# EAGLE design ampli_piezo (EAGLE 6.1)
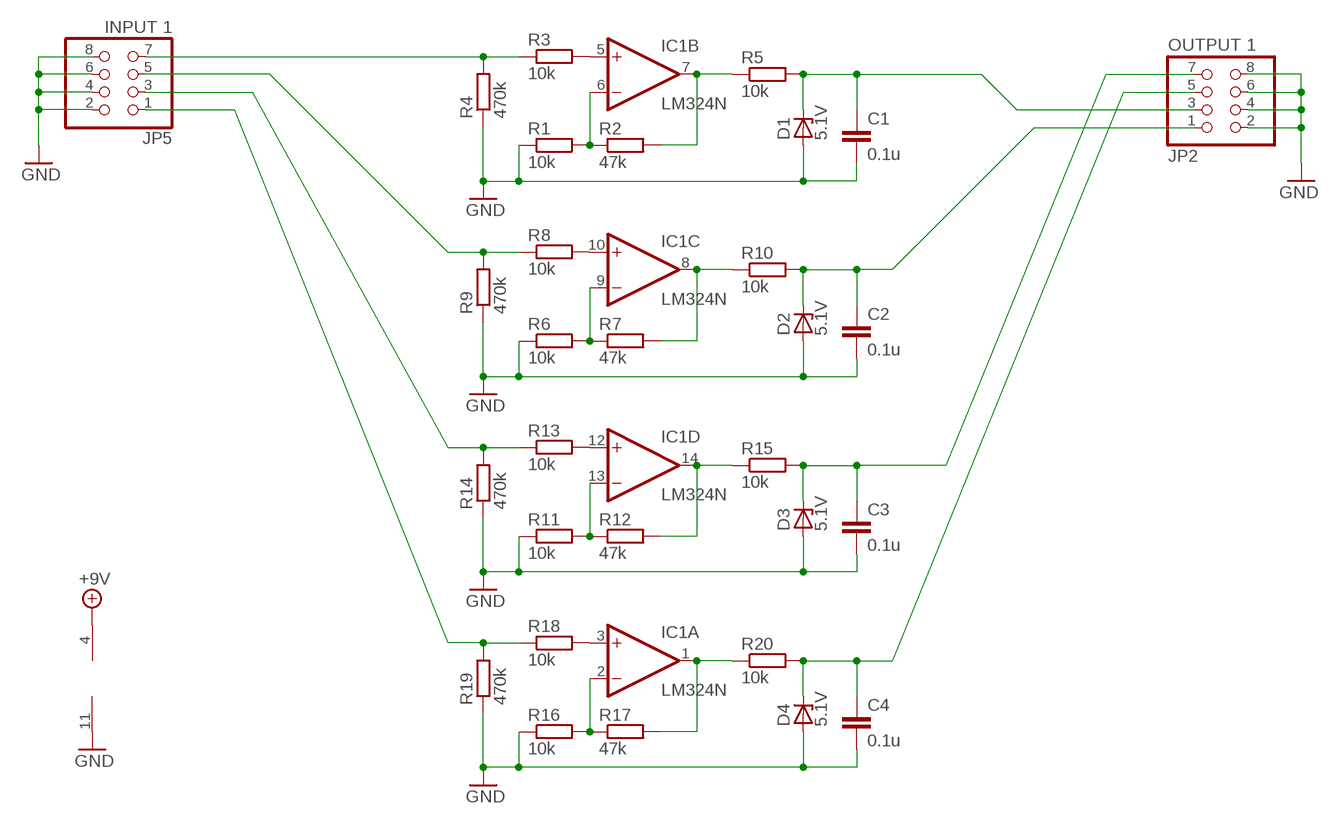
[diagram p0: schematic, sheet 1]

## Parts
C1  0.1u  C-EU050-025X075  [C050-025X075]
C2  0.1u  C-EU050-025X075  [C050-025X075]
C3  0.1u  C-EU050-025X075  [C050-025X075]
C4  0.1u  C-EU050-025X075  [C050-025X075]
D1  5.1V  ZENER-DIODEDO35Z10  [DO35Z10]
D2  5.1V  ZENER-DIODEDO35Z10  [DO35Z10]
D3  5.1V  ZENER-DIODEDO35Z10  [DO35Z10]
D4  5.1V  ZENER-DIODEDO35Z10  [DO35Z10]
IC1  LM324N  [DIL14]
JP2  OUTPUT 1  PINHD-2X4/90  [2X04/90]
JP5  INPUT 1  PINHD-2X4/90  [2X04/90]
R1  10k  R-EU_0207/10  [0207/10]
R2  47k  R-EU_0207/10  [0207/10]
R3  10k  R-EU_0207/10  [0207/10]
R4  470k  R-EU_0207/10  [0207/10]
R5  10k  R-EU_0207/10  [0207/10]
R6  10k  R-EU_0207/10  [0207/10]
R7  47k  R-EU_0207/10  [0207/10]
R8  10k  R-EU_0207/10  [0207/10]
R9  470k  R-EU_0207/10  [0207/10]
R10  10k  R-EU_0207/10  [0207/10]
R11  10k  R-EU_0207/10  [0207/10]
R12  47k  R-EU_0207/10  [0207/10]
R13  10k  R-EU_0207/10  [0207/10]
R14  470k  R-EU_0207/10  [0207/10]
R15  10k  R-EU_0207/10  [0207/10]
R16  10k  R-EU_0207/10  [0207/10]
R17  47k  R-EU_0207/10  [0207/10]
R18  10k  R-EU_0207/10  [0207/10]
R19  470k  R-EU_0207/10  [0207/10]
R20  10k  R-EU_0207/10  [0207/10]

## Nets
+9V: IC1.4(P:V+)
GND: C1.2 C2.2 C3.2 C4.2 D1.A D2.A D3.A D4.A IC1.11(P:V-) JP2.2 JP2.4 JP2.6 JP2.8 JP5.2 JP5.4 JP5.6 JP5.8 R1.1 R4.1 R6.1 R9.1 R11.1 R14.1 R16.1 R19.1
N$1: IC1.12(D:+IN) R13.2
N$2: IC1.10(C:+IN) R8.2
N$3: IC1.5(B:+IN) R3.2
N$4: IC1.3(A:+IN) R18.2
N$5: IC1.6(B:-IN) R1.2 R2.1
N$6: IC1.14(D:OUT) R12.2 R15.1
N$7: IC1.1(A:OUT) R17.2 R20.1
N$10: IC1.7(B:OUT) R2.2 R5.1
N$12: JP5.7 R3.1 R4.2
N$13: C1.1 D1.C JP2.3 R5.2
N$14: IC1.9(C:-IN) R6.2 R7.1
N$15: IC1.8(C:OUT) R7.2 R10.1
N$17: JP5.5 R8.1 R9.2
N$18: C2.1 D2.C JP2.1 R10.2
N$19: IC1.13(D:-IN) R11.2 R12.1
N$22: JP5.3 R13.1 R14.2
N$23: C3.1 D3.C JP2.7 R15.2
N$24: IC1.2(A:-IN) R16.2 R17.1
N$27: JP5.1 R18.1 R19.2
N$28: C4.1 D4.C JP2.5 R20.2

## Library data of the parts
C1-C4 = rcl:C-EU: CAPACITOR, European symbol
D1-D4 = diode:ZENER-DIODE: Z-Diode
IC1 = linear:LM324: OP AMP
JP2 JP5 = pinhead:PINHD-2X4: PIN HEADER
R1-R20 = resistor:R-EU_: RESISTOR, European symbol

## Board
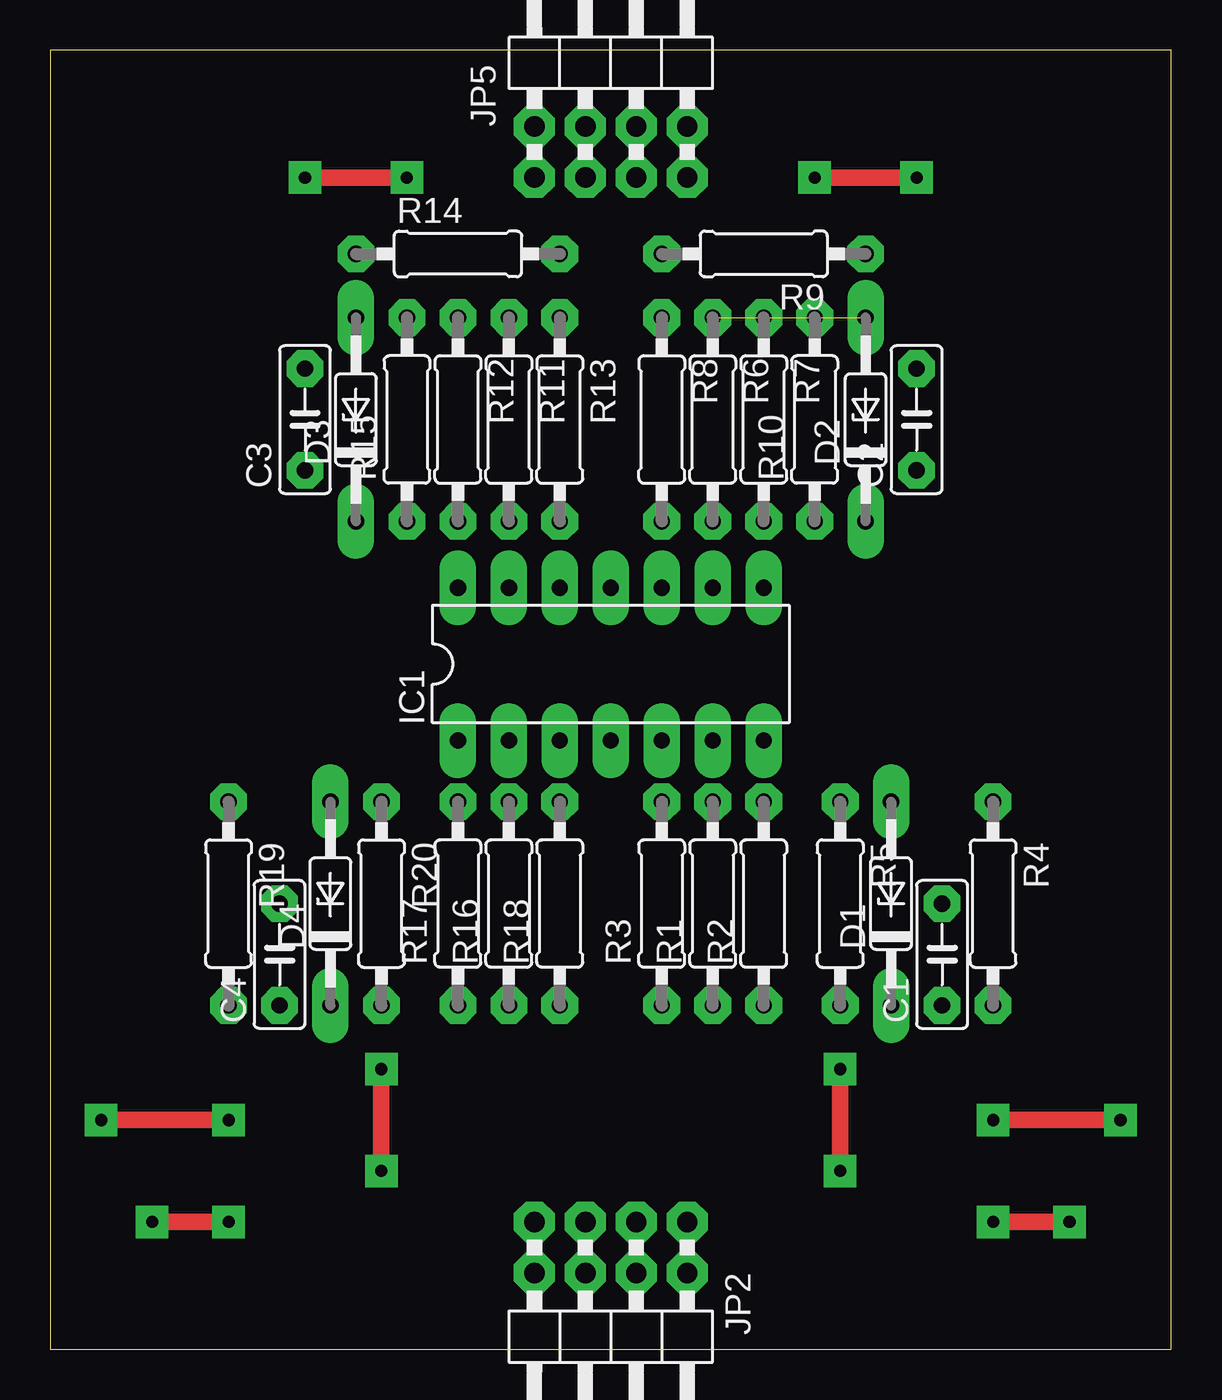
[diagram p1: board, top side]
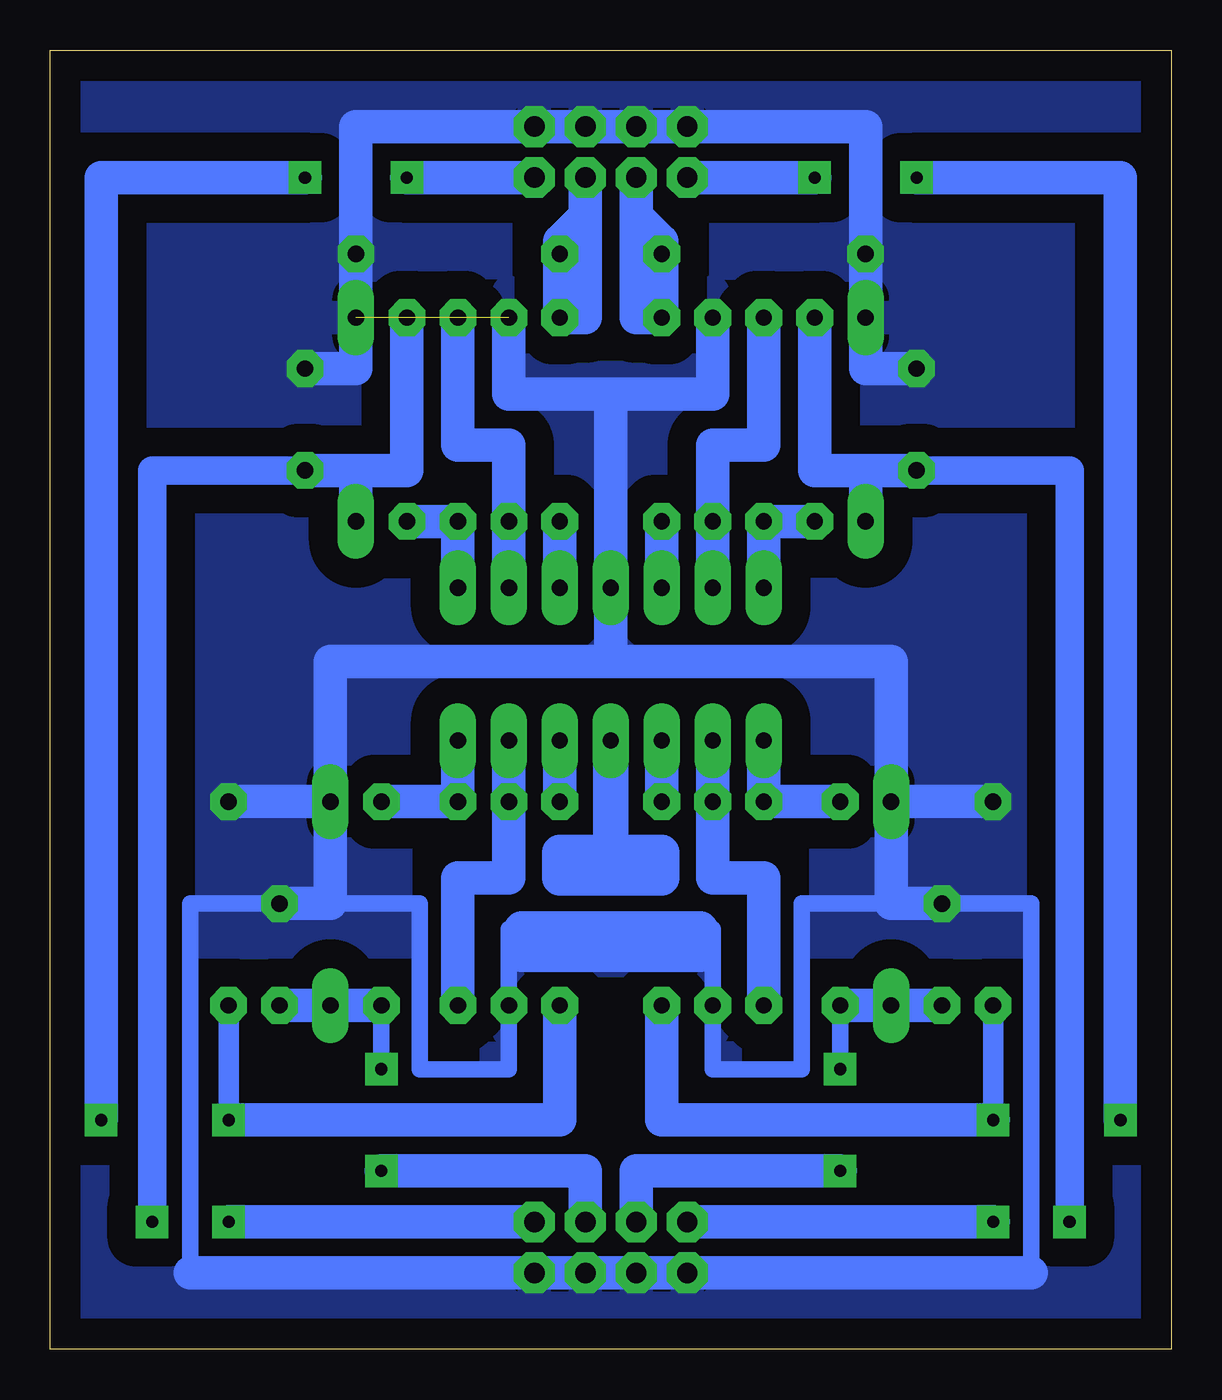
[diagram p2: board, bottom side, seen from below]

Size 55.88 x 64.77 mm. Coordinates in mm from the lower left corner, seen from the top.
Outline: 0,0 55.88,0 55.88,64.77 0,64.77 0,0
Copper layers (1*16): Top 0.035mm / dielectric 1.5mm / Bottom 0.035mm
Design rules: minimum track width 20mil, minimum drill 20mil, track to track 20mil, track to pad 20mil, pad to pad 20mil, via to via 20mil, smd to smd 10mil, copper to edge 60mil, drill to drill 20mil, minimum pad ring 20mil, minimum via ring 20mil, stop-mask expansion 4mil, vias tented up to drill 0mil, thermal gap 10mil

### Footprints (pad centres in the part's own frame; a part is rotated, then mirrored left to right if it is on the bottom)
C050-025X075 = drill 0.813 octagon: 1 -2.54,0; 2 2.54,0
DO35Z10 = drill 0.813 long: A 5.08,0; C -5.08,0
DIL14 = drill 0.813 long: 1 -7.62,-3.81; 2 -5.08,-3.81; 3 -2.54,-3.81; 4 0,-3.81; 5 2.54,-3.81; 6 5.08,-3.81; 7 7.62,-3.81; 8 7.62,3.81; 9 5.08,3.81; 10 2.54,3.81; 11 0,3.81; 12 -2.54,3.81; 13 -5.08,3.81; 14 -7.62,3.81
2X04/90 = drill 1.016 octagon: 1 -3.81,-6.35; 2 -3.81,-3.81; 3 -1.27,-6.35; 4 -1.27,-3.81; 5 1.27,-6.35; 6 1.27,-3.81; 7 3.81,-6.35; 8 3.81,-3.81
0207/10 = drill 0.813 octagon: 1 -5.08,0; 2 5.08,0

### Placement (x,y rotation side)
C1  44.45,19.68 90 top
C2  43.18,46.36 90 top
C3  12.7,46.36 90 top
C4  11.43,19.68 90 top
D1  41.91,22.22 90 top
D2  40.64,46.36 90 top
D3  15.24,46.36 90 top
D4  13.97,22.22 90 top
IC1  27.94,34.16 0 top
JP2  27.94,0 180 top
JP5  27.94,64.77 0 top
R1  33.02,22.22 90 top
R2  35.56,22.22 90 top
R3  30.48,22.22 90 top
R4  46.99,22.22 270 top
R5  39.37,22.22 270 top
R6  33.02,46.36 270 top
R7  35.56,46.36 270 top
R8  30.48,46.36 270 top
R9  35.56,54.61 180 top
R10  38.1,46.36 90 top
R11  22.86,46.36 270 top
R12  20.32,46.36 270 top
R13  25.4,46.36 270 top
R14  20.32,54.61 0 top
R15  17.78,46.36 90 top
R16  22.86,22.22 90 top
R17  20.32,22.22 90 top
R18  25.4,22.22 90 top
R19  8.89,22.22 270 top
R20  16.51,22.22 270 top

### Tracks (layer width: path | path; a pad name or v marks a point on that pad's centre or on a via)
+9V
  Bottom 1.778: 27.94,30.48 IC1.4 27.94,23.49 | 27.94,23.49 25.4,23.49 25.4,24.76 30.48,24.76 30.48,23.49 27.94,23.49
GND  (1 unrouted)
  Bottom 0.813: 23.49,20.95 22.86,20.95 R16.1 22.86,13.97 18.41,13.97 18.41,22.22 13.97,22.22 | 41.91,22.22 37.46,22.22 37.46,13.97 33.02,13.97 R1.1 33.02,20.95 32.38,20.95 32.38,19.68 | C1.2 48.89,22.22 48.89,3.81 | C4.2 6.99,22.22 6.99,3.81
  Bottom 1.676: R6.1 33.02,47.62 27.94,47.62 | 27.94,47.62 22.86,47.62 R11.1 | 27.94,47.62 IC1.11 27.94,34.29 | C1.2 41.91,22.22 D1.A | D1.A 41.91,34.29 27.94,34.29 | D4.A 13.97,34.29 27.94,34.29 | D4.A 13.97,22.22 C4.2 | D4.A R19.1 | D1.A R4.1 | 48.89,3.81 JP2.2 JP2.4 JP2.6 JP2.8 6.99,3.81 | C2.2 40.64,48.9 D2.A R9.1 40.64,60.96 JP5.8 JP5.6 JP5.4 JP5.2 15.24,60.96 R14.1 D3.A 15.24,48.9 C3.2
  Bottom 1.778: 23.49,20.95 32.38,20.95 | 32.38,19.68 23.49,19.68
  pour Bottom (isolate 1.422): 0.64,64.77 55.88,64.77 55.88,0 0,0 0,64.77
N$1
  Bottom 1.676: R13.2 IC1.12
N$2
  Bottom 1.676: R8.2 IC1.10
N$3
  Bottom 1.676: IC1.5 R3.2
N$4
  Bottom 1.676: IC1.3 R18.2
N$5
  Bottom 1.676: IC1.6 R1.2 33.02,23.49 35.56,23.49 R2.1
N$6
  Bottom 1.676: IC1.14 R12.2 R15.1
N$7
  Bottom 1.676: IC1.1 R17.2 R20.1
N$10
  Bottom 1.676: IC1.7 R2.2 R5.1
N$12  (via drill 0.6)
  Top 0.813: v38.1,58.42 v43.18,58.42 | v53.34,11.43 v46.99,11.43
  Bottom 1.016: v46.99,11.43 R4.2
  Bottom 1.676: R3.1 30.48,11.43 v46.99,11.43 | JP5.7 v38.1,58.42 | v43.18,58.42 53.34,58.42 v53.34,11.43
N$13  (via drill 0.6)
  Top 0.813: v39.37,13.97 v39.37,8.89
  Bottom 0.813: R5.2 v39.37,13.97
  Bottom 1.676: R5.2 D1.C C1.1 | v39.37,8.89 29.21,8.89 JP2.3
N$14
  Bottom 1.676: IC1.9 R6.2 33.02,45.09 35.56,45.09 R7.1
N$15
  Bottom 1.676: R10.1 R7.2 IC1.8
N$17
  Bottom 1.676: 29.21,56.52 29.21,51.44 R8.1 R9.2 30.48,55.25 29.21,56.52 | 29.21,56.52 JP5.5
N$18  (via drill 0.6)
  Top 0.813: v50.8,6.35 v46.99,6.35
  Bottom 1.422: C2.1 50.8,43.82 v50.8,6.35
  Bottom 1.676: R10.2 38.1,43.82 40.64,43.82 | v46.99,6.35 JP2.1 | D2.C 40.64,43.82 | 40.64,43.82 C2.1
N$19
  Bottom 1.676: IC1.13 R11.2 22.86,45.09 20.32,45.09 R12.1
N$22
  Bottom 1.676: 26.67,56.52 26.67,51.44 R13.1 R14.2 25.4,55.25 26.67,56.52 | 26.67,56.52 JP5.3
N$23  (via drill 0.6)
  Top 0.813: v5.08,6.35 v8.89,6.35
  Bottom 1.422: C3.1 5.08,43.82 v5.08,6.35
  Bottom 1.676: v8.89,6.35 JP2.7 | D3.C 15.24,43.82 | 15.24,43.82 C3.1 | R15.2 17.78,43.82 15.24,43.82
N$24
  Bottom 1.676: IC1.2 R16.2 22.86,23.49 20.32,23.49 R17.1
N$27  (via drill 0.6)
  Top 0.813: v17.78,58.42 v12.7,58.42 | v2.54,11.43 v8.89,11.43
  Bottom 1.016: v8.89,11.43 R19.2
  Bottom 1.676: R18.1 25.4,11.43 v8.89,11.43 | JP5.1 v17.78,58.42 | v12.7,58.42 2.54,58.42 v2.54,11.43
N$28  (via drill 0.6)
  Top 0.813: v16.51,13.97 v16.51,8.89
  Bottom 0.813: R20.2 v16.51,13.97
  Bottom 1.676: R20.2 D4.C C4.1 | v16.51,8.89 26.67,8.89 JP2.5